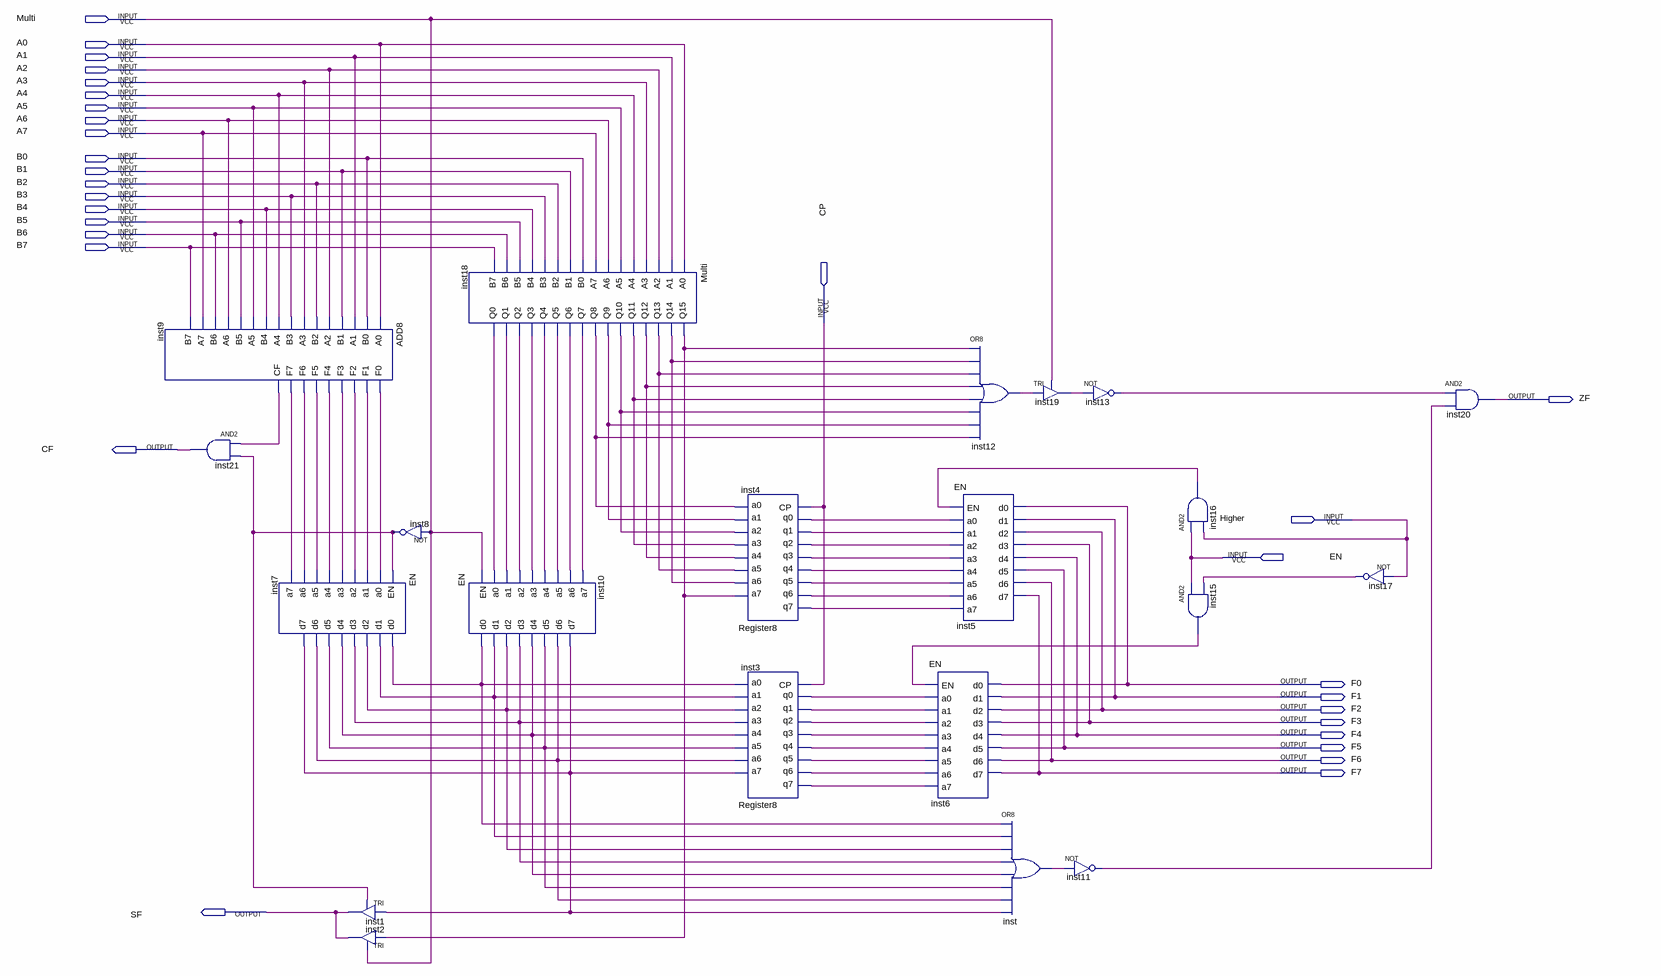
[diagram p0: schematic sheet]
// Quartus schematic ALU.bdf as structural Verilog: 21 symbols, 31 pins
module ALU (
  input  Multi,
  input  A0,
  input  A1,
  input  A2,
  input  A3,
  input  A4,
  input  A5,
  input  A6,
  input  A7,
  input  B0,
  input  B1,
  input  B2,
  input  B3,
  input  B4,
  input  B5,
  input  B6,
  input  B7,
  input  CP,
  input  Higher,
  input  EN,
  output ZF,
  output CF,
  output F0,
  output F1,
  output F2,
  output F3,
  output F4,
  output F5,
  output F6,
  output F7,
  output SF
);

  wire inst3_q0, inst3_q1, inst3_q2, inst3_q3, inst3_q4, inst3_q5, inst3_q6, inst3_q7, inst4_q0, inst4_q1,
       inst4_q2, inst4_q3, inst4_q4, inst4_q5, inst4_q6, inst4_q7, inst7_d0, inst7_d1, inst7_d2, inst7_d3,
       inst7_d4, inst7_d5, inst7_d6, inst7_d7, inst8_out, inst9_cf, inst9_f0, inst9_f1, inst9_f2, inst9_f3,
       inst9_f4, inst9_f5, inst9_f6, inst9_f7, inst11_out, inst12_out, inst13_out, inst15_out, inst16_out,
       inst17_out, inst18_q0, inst18_q1, inst18_q2, inst18_q3, inst18_q4, inst18_q5, inst18_q6, inst18_q7,
       inst18_q8, inst18_q9, inst18_q10, inst18_q11, inst18_q12, inst18_q13, inst18_q14, inst18_q15,
       inst19_out, inst_out;

  ADD8 inst9 (
    .A0(A0), .B0(B0), .A1(A1), .B1(B1), .A2(A2), .B2(B2), .A3(A3), .B3(B3), .A4(A4), .B4(B4), .A5(A5),
    .B5(B5), .A6(A6), .B6(B6), .A7(A7), .B7(B7), .F0(inst9_f0), .F1(inst9_f1), .F2(inst9_f2), .F3(inst9_f3),
    .F4(inst9_f4), .F5(inst9_f5), .F6(inst9_f6), .F7(inst9_f7), .CF(inst9_cf));
  and inst21 (CF, inst9_cf, inst8_out);
  EN inst7 (
    .EN(inst8_out), .a0(inst9_f0), .a1(inst9_f1), .a2(inst9_f2), .a3(inst9_f3), .a4(inst9_f4), .a5(inst9_f5),
    .a6(inst9_f6), .a7(inst9_f7), .d0(inst7_d0), .d1(inst7_d1), .d2(inst7_d2), .d3(inst7_d3), .d4(inst7_d4),
    .d5(inst7_d5), .d6(inst7_d6), .d7(inst7_d7));
  TRI inst1 (.IN(inst7_d7), .OE(inst8_out), .OUT(SF));
  TRI inst2 (.IN(inst18_q15), .OE(Multi), .OUT(SF));
  not inst8 (inst8_out, Multi);
  Multi inst18 (
    .A0(A0), .A1(A1), .A2(A2), .A3(A3), .A4(A4), .A5(A5), .A6(A6), .A7(A7), .B0(B0), .B1(B1), .B2(B2),
    .B3(B3), .B4(B4), .B5(B5), .B6(B6), .B7(B7), .Q15(inst18_q15), .Q14(inst18_q14), .Q13(inst18_q13),
    .Q12(inst18_q12), .Q11(inst18_q11), .Q10(inst18_q10), .Q9(inst18_q9), .Q8(inst18_q8), .Q7(inst18_q7),
    .Q6(inst18_q6), .Q5(inst18_q5), .Q4(inst18_q4), .Q3(inst18_q3), .Q2(inst18_q2), .Q1(inst18_q1),
    .Q0(inst18_q0));
  EN inst10 (
    .EN(Multi), .a0(inst18_q0), .a1(inst18_q1), .a2(inst18_q2), .a3(inst18_q3), .a4(inst18_q4),
    .a5(inst18_q5), .a6(inst18_q6), .a7(inst18_q7), .d0(inst7_d0), .d1(inst7_d1), .d2(inst7_d2),
    .d3(inst7_d3), .d4(inst7_d4), .d5(inst7_d5), .d6(inst7_d6), .d7(inst7_d7));
  Register8 inst4 (
    .CP(CP), .a7(inst18_q15), .a6(inst18_q14), .a5(inst18_q13), .a4(inst18_q12), .a3(inst18_q11),
    .a2(inst18_q10), .a1(inst18_q9), .a0(inst18_q8), .q7(inst4_q7), .q6(inst4_q6), .q5(inst4_q5),
    .q4(inst4_q4), .q3(inst4_q3), .q2(inst4_q2), .q1(inst4_q1), .q0(inst4_q0));
  Register8 inst3 (
    .CP(CP), .a7(inst7_d7), .a6(inst7_d6), .a5(inst7_d5), .a4(inst7_d4), .a3(inst7_d3), .a2(inst7_d2),
    .a1(inst7_d1), .a0(inst7_d0), .q7(inst3_q7), .q6(inst3_q6), .q5(inst3_q5), .q4(inst3_q4), .q3(inst3_q3),
    .q2(inst3_q2), .q1(inst3_q1), .q0(inst3_q0));
  EN inst5 (
    .EN(inst16_out), .a0(inst4_q0), .a1(inst4_q1), .a2(inst4_q2), .a3(inst4_q3), .a4(inst4_q4),
    .a5(inst4_q5), .a6(inst4_q6), .a7(inst4_q7), .d0(F0), .d1(F1), .d2(F2), .d3(F3), .d4(F4), .d5(F5),
    .d6(F6), .d7(F7));
  EN inst6 (
    .EN(inst15_out), .a0(inst3_q0), .a1(inst3_q1), .a2(inst3_q2), .a3(inst3_q3), .a4(inst3_q4),
    .a5(inst3_q5), .a6(inst3_q6), .a7(inst3_q7), .d0(F0), .d1(F1), .d2(F2), .d3(F3), .d4(F4), .d5(F5),
    .d6(F6), .d7(F7));
  or inst12 (inst12_out, inst18_q15, inst18_q14, inst18_q13, inst18_q12, inst18_q11, inst18_q10, inst18_q9, inst18_q8);
  or inst (inst_out, inst7_d0, inst7_d1, inst7_d2, inst7_d3, inst7_d4, inst7_d5, inst7_d6, inst7_d7);
  TRI inst19 (.IN(inst12_out), .OE(Multi), .OUT(inst19_out));
  not inst11 (inst11_out, inst_out);
  not inst13 (inst13_out, inst19_out);
  and inst16 (inst16_out, EN, Higher);
  and inst15 (inst15_out, EN, inst17_out);
  not inst17 (inst17_out, Higher);
  and inst20 (ZF, inst13_out, inst11_out);
endmodule
